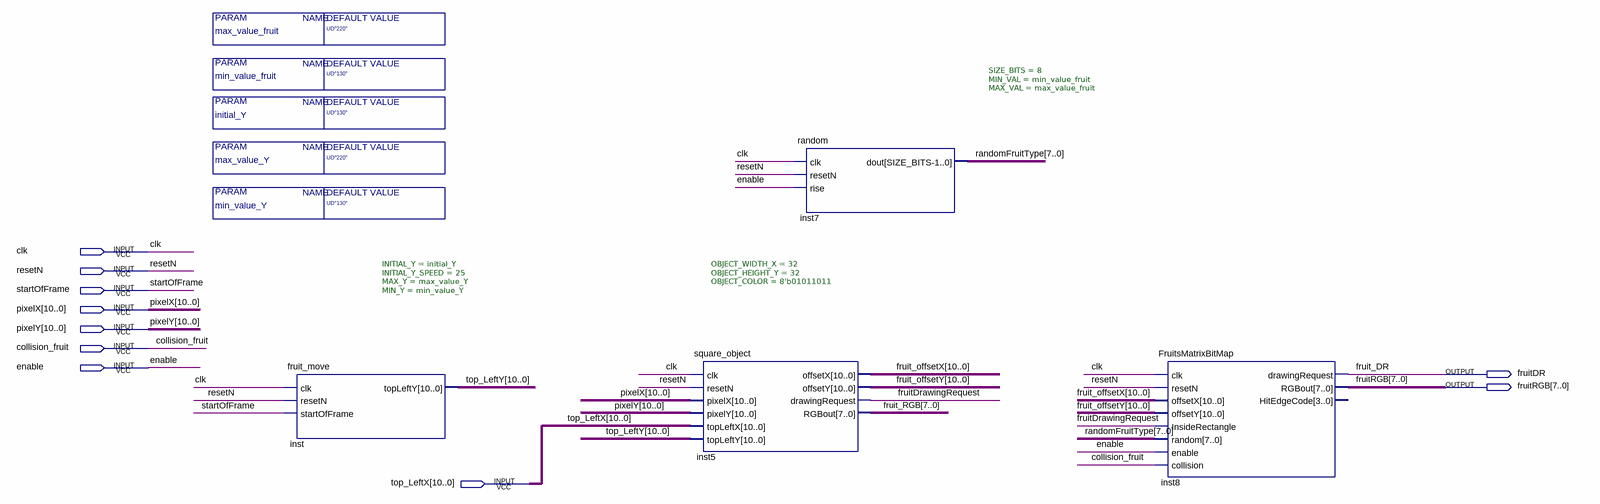
[diagram p0: schematic sheet]
// Quartus schematic movingFruitBlock.bdf as structural Verilog: 4 symbols, 10 pins
module movingFruitBlock #(parameter initial_Y = "UD\"130\"", parameter min_value_Y = "UD\"130\"", parameter max_value_Y = "UD\"220\"", parameter max_value_fruit = "UD\"220\"", parameter min_value_fruit = "UD\"130\"") (
  input  clk,
  input  resetN,
  input  startOfFrame,
  input  [10:0] pixelX,
  input  [10:0] pixelY,
  input  collision_fruit,
  input  enable,
  input  [10:0] top_LeftX,
  output fruitDR,
  output [7:0] fruitRGB
);

  wire fruitDrawingRequest;
  wire [7:0] fruit_RGB, randomFruitType;
  wire [10:0] fruit_offsetX, fruit_offsetY, top_LeftY;

  fruit_move #(.INITIAL_Y(initial_Y), .INITIAL_Y_SPEED(25), .MAX_Y(max_value_Y), .MIN_Y(min_value_Y)) inst (
    .clk(clk), .resetN(resetN), .startOfFrame(startOfFrame), .topLeftY(top_LeftY));
  square_object #(.OBJECT_WIDTH_X(32), .OBJECT_HEIGHT_Y(32), .OBJECT_COLOR(8'b01011011)) inst5 (
    .clk(clk), .resetN(resetN), .pixelX(pixelX), .pixelY(pixelY), .topLeftX(top_LeftX), .topLeftY(top_LeftY),
    .offsetX(fruit_offsetX), .offsetY(fruit_offsetY), .drawingRequest(fruitDrawingRequest), .RGBout(fruit_RGB));
  random #(.SIZE_BITS(8), .MIN_VAL(min_value_fruit), .MAX_VAL(max_value_fruit)) inst7 (
    .clk(clk), .resetN(resetN), .rise(enable), .dout(randomFruitType));
  FruitsMatrixBitMap inst8 (
    .clk(clk), .resetN(resetN), .offsetX(fruit_offsetX), .offsetY(fruit_offsetY),
    .InsideRectangle(fruitDrawingRequest), .random(randomFruitType), .enable(enable),
    .collision(collision_fruit), .drawingRequest(fruitDR), .RGBout(fruitRGB));  // open: HitEdgeCode

  // Other names for the same wires on the sheet: fruit_DR = fruitDR
endmodule
